# EAGLE schematic V0.1 (EAGLE 9.2.1)
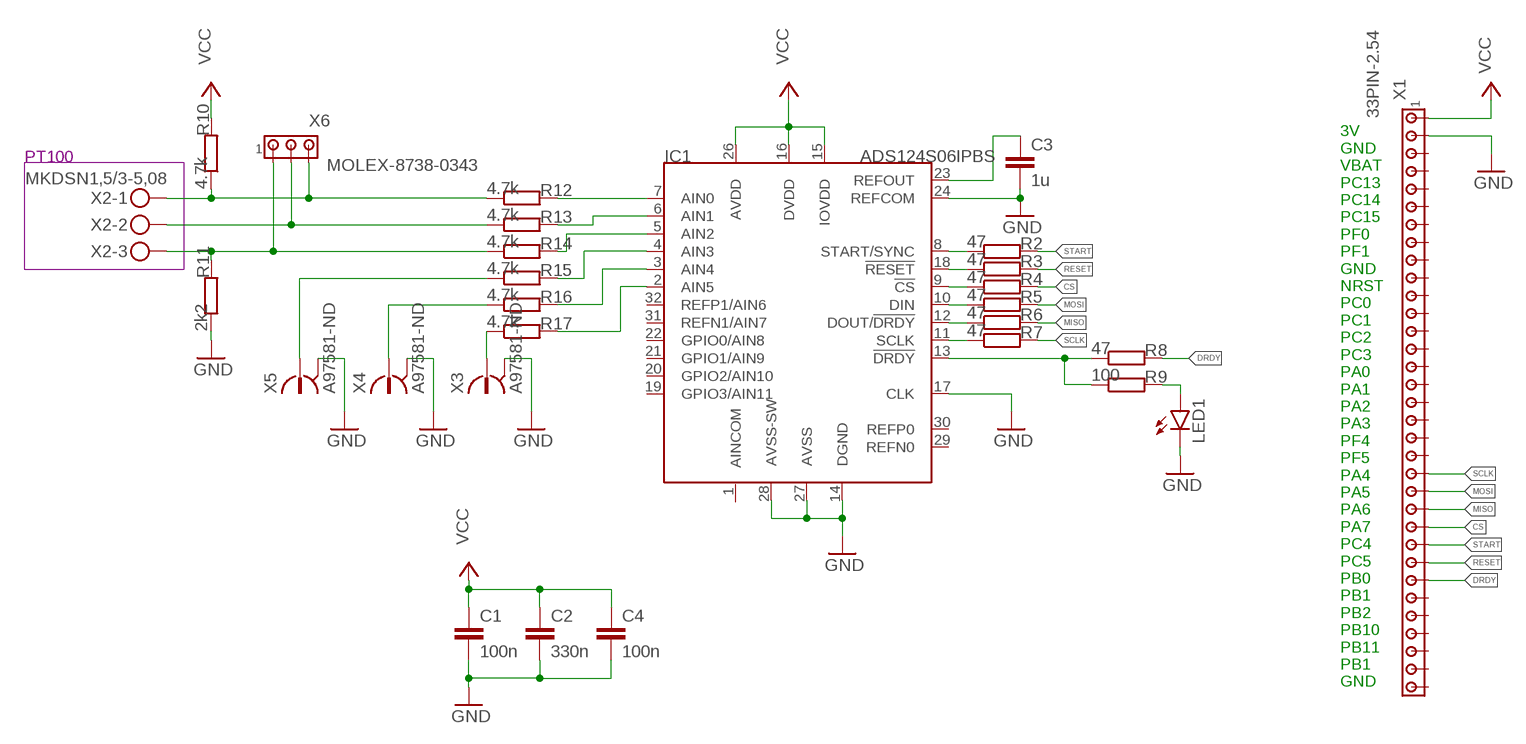
[diagram p0: schematic, sheet 1]

## Parts
C1  100n  C-EUC0603  [C0603]
C2  330n  C-EUC0603  [C0603]
C3  1u  C-EUC0603  [C0603]
C4  100n  C-EUC0603  [C0603]
IC1  ADS124S06IPBS  ADS124S0XIPBS  [TQFP32-05]
LED1  LEDSML0603  [SML0603]
R2  47  R-EU_R0603  [R0603]
R3  47  R-EU_R0603  [R0603]
R4  47  R-EU_R0603  [R0603]
R5  47  R-EU_R0603  [R0603]
R6  47  R-EU_R0603  [R0603]
R7  47  R-EU_R0603  [R0603]
R8  47  R-EU_R0603  [R0603]
R9  100  R-EU_R0603  [R0603]
R10  4.7k  R-EU_R0603  [R0603]
R11  2k2  R-EU_R0805W  [R0805W]
R12  4.7k  R-EU_R0603  [R0603]
R13  4.7k  R-EU_R0603  [R0603]
R14  4.7k  R-EU_R0603  [R0603]
R15  4.7k  R-EU_R0603  [R0603]
R16  4.7k  R-EU_R0603  [R0603]
R17  4.7k  R-EU_R0603  [R0603]
X1  33PIN-2.54  [1X33]
X2  MKDSN1,5/3-5,08  [MKDSN1,5/3-5,08]
X3  A97581-ND  [1634503]
X4  A97581-ND  [1634503]
X5  A97581-ND  [1634503]
X6  MOLEX-8738-0343  [MOLEX-87438-0343]

## Nets
CS: R4.2 X1.24
DRDY: R8.2 X1.27
GND: C1.2 C2.2 C3.2 C4.2 IC1.14(DGND) IC1.17(CLK) IC1.24(REFCOM) IC1.27(AVSS) IC1.28(AVSS-SW) LED1.C R11.1 X1.2 X3.2 X3.3 X3.4 X3.5 X4.2 X4.3 X4.4 X4.5 X5.2 X5.3 X5.4 X5.5
MISO: R6.2 X1.23
MOSI: R5.2 X1.22
N$1: IC1.8(START/SYNC) R2.1
N$2: IC1.18(!RESET) R3.1
N$3: IC1.9(!CS) R4.1
N$4: IC1.10(DIN) R5.1
N$5: IC1.12(DOUT/!DRDY) R6.1
N$6: IC1.11(SCLK) R7.1
N$7: IC1.13(!DRDY) R8.1 R9.1
N$8: R10.1 R12.1 X2.1 X6.3 X6.3_1
N$9: R13.1 X2.2 X6.2 X6.2_1
N$10: R11.2 R14.1 X2.3 X6.1 X6.1_1
N$11: R15.1 X5.1
N$12: IC1.3(AIN4) R16.2
N$13: IC1.2(AIN5) R17.2
N$14: LED1.A R9.2
N$15: C3.1 IC1.23(REFOUT)
N$16: IC1.4(AIN3) R15.2
N$17: R16.1 X4.1
N$18: R17.1 X3.1
N$19: IC1.5(AIN2) R14.2
N$20: IC1.7(AIN0) R12.2
N$21: IC1.6(AIN1) R13.2
RESET: R3.2 X1.26
SCLK: R7.2 X1.21
START: R2.2 X1.25
VCC: C1.1 C2.1 C4.1 IC1.15(IOVDD) IC1.16(DVDD) IC1.26(AVDD) R10.2 X1.1
Unconnected: IC1.1(AINCOM) IC1.19(GPIO3/AIN11) IC1.20(GPIO2/AIN10) IC1.21(GPIO1/AIN9) IC1.22(GPIO0/AIN8) IC1.29(REFN0) IC1.30(REFP0) IC1.31(REFN1/AIN7) IC1.32(REFP1/AIN6) X1.3 X1.4 X1.5 X1.6 X1.7 X1.8 X1.9 X1.10 X1.11 X1.12 X1.13 X1.14 X1.15 X1.16 X1.17 X1.18 X1.19 X1.20 X1.28 X1.29 X1.30 X1.31 X1.32 X1.33

## Notes on the sheet
- PT100
- 3V
  GND
  VBAT
  PC13
  PC14
  PC15
  PF0
  PF1
  GND
  NRST
  PC0
  PC1
  PC2
  PC3
  PA0
  PA1
  PA2
  PA3
  PF4
  PF5
  PA4
  PA5
  PA6
  PA7
  PC4
  PC5
  PB0
  PB1
  PB2
  PB10
  PB11
  PB1
  GND

## Library data of the parts
C1 C4 = rcl:C-EU: CAPACITOR, European symbol; DIGIKEY_NR: 1276-6439-1-ND; DIGIKEY_PRICE: 0.10; SPICEPREFIX: C
C2 = rcl:C-EU: CAPACITOR, European symbol; DIGIKEY_NR: 490-6050-1-ND; DIGIKEY_PRICE: 0.22; SPICEPREFIX: C
C3 = rcl:C-EU: CAPACITOR, European symbol; DIGIKEY_NR: 1276-1182-1-ND; DIGIKEY_PRICE: 0.10; SPICEPREFIX: C
IC1 = ADC-Erweiterung:ADS124S0X; DIGIKEY_NR: 296-45188-ND; DIGIKEY_PRICE: 10.15
LED1 = led:LED: LED OSRAM: - CHIPLED LG R971, LG N971, LY N971, LG Q971, LY Q971, LO R971, LY R971 LH N974, LH R974 LS Q976, LO Q976, LY Q976 LO Q996 - Hyper CHIPLED LW Q18S LB Q993, LB Q99A, LB R99A - SideLED LS A670, LO A670, LY A670, LG A670, LP A670 LB A673, LV A673, LT A673, LW A673 LH A674 LY A675 LS A676, LA A676, LO A676, LY A676, LW A676 LS A679, LY A679, LG A679 - Hyper Micro SIDELED® LS Y876, LA Y876, LO Y876, LY Y876 LT Y87S - SmartLED LW L88C, LW L88S LB L89C, LB L89S, LG L890 LS L89K, LO L89K, LY L89K LS L896, LA L896, LO L896, LY L896 - TOPLED LS T670, LO T670, LY T670, LG T670, LP T670 LSG T670, LSP T670, LSY T670, LOP T670, LYG T670 LG T671, LOG T671, LSG T671 LB T673, LV T673, LT T673, LW T673 LH T674 LS T676, LA T676, LO T676, LY T676, LB T676, LH T676, LSB T676, LW T676 LB T67C, LV T67C, LT T67C, LS T67K, LO T67K, LY T67K, LW E67C LS E67B, LA E67B, LO E67B, LY E67B, LB E67C, LV E67C, LT E67C LW T67C LS T679, LY T679, LG T679 LS T770, LO T770, LY T770, LG T770, LP T770 LB T773, LV T773, LT T773, LW T773 LH T774 LS E675, LA E675, LY E675, LS T675 LS T776, LA T776, LO T776, LY T776, LB T776 LHGB T686 LT T68C, LB T68C - Hyper Mini TOPLED® LB M676 - Mini TOPLED Santana® LG M470 LS M47K, LO M47K, LY M47K Source: http://www.osram.convergy.de LUXEON: - LUMILED® LXK2-PW12-R00, LXK2-PW12-S00, LXK2-PW14-U00, LXK2-PW14-V00 LXK2-PM12-R00, LXK2-PM12-S00, LXK2-PM14-U00 LXK2-PE12-Q00, LXK2-PE12-R00, LXK2-PE12-S00, LXK2-PE14-T00, LXK2-PE14-U00 LXK2-PB12-K00, LXK2-PB12-L00, LXK2-PB12-M00, LXK2-PB14-N00, LXK2-PB14-P00, LXK2-PB14-Q00 LXK2-PR12-L00, LXK2-PR12-M00, LXK2-PR14-Q00, LXK2-PR14-R00 LXK2-PD12-Q00, LXK2-PD12-R00, LXK2-PD12-S00 LXK2-PH12-R00, LXK2-PH12-S00 LXK2-PL12-P00, LXK2-PL12-Q00, LXK2-PL12-R00 Source: www.luxeon.com KINGBRIGHT: KA-3528ASYC Source: www.kingbright.com; DIGIKEY_NR: 475-3118-1-ND; DIGIKEY_PRICE: 0.52
R2-R8 = rcl:R-EU_: RESISTOR, European symbol; DIGIKEY_NR: 311-470GRCT-ND; DIGIKEY_PRICE: 0.10; SPICEPREFIX: R
R9 = rcl:R-EU_: RESISTOR, European symbol; DIGIKEY_NR: 311-100DCT-ND; DIGIKEY_PRICE: 0.20; SPICEPREFIX: R
R10 R12-R17 = rcl:R-EU_: RESISTOR, European symbol; DIGIKEY_NR: 311-4.70KHRCT-ND; DIGIKEY_PRICE: 0.10; SPICEPREFIX: R
R11 = rcl:R-EU_: RESISTOR, European symbol; DIGIKEY_NR: 408-1635-1-ND; DIGIKEY_PRICE: 4.37; SPICEPREFIX: R
X1 = ADC-Erweiterung:33PIN-2.54; DIGIKEY_NR: 609-2223-ND; DIGIKEY_PRICE: 1.41
X2 = ADC-Erweiterung:MKDSN1,5/3-5,08: MKDSN 1,5/ 3-5,08 Printklemme Nennstrom: 13,5 A Nennspannung: 250 V Rastermaß: 5,08 mm Polzahl: 3 Anschlussart: Schraubanschluss Montage: Löten Anschlussrichtung Leiter/Platine: 0 ° Artikelnummer: 1729131 Source: http://eshop.phoenixcontact.com .. 1729131.pdf; DIGIKEY_NR: 277-14503-ND; DIGIKEY_PRICE: 1.57
X3-X5 = ADC-Erweiterung:A97581-ND; DIGIKEY_NR: A97581-ND; DIGIKEY_PRICE: 1.73
X6 = ADC-Erweiterung:MOLEX-8738-0343; DIGIKEY_NR: WM7647CT-ND; DIGIKEY_PRICE: 0.81